# Altium schematic sheet Sheet1.SchDoc
size A4
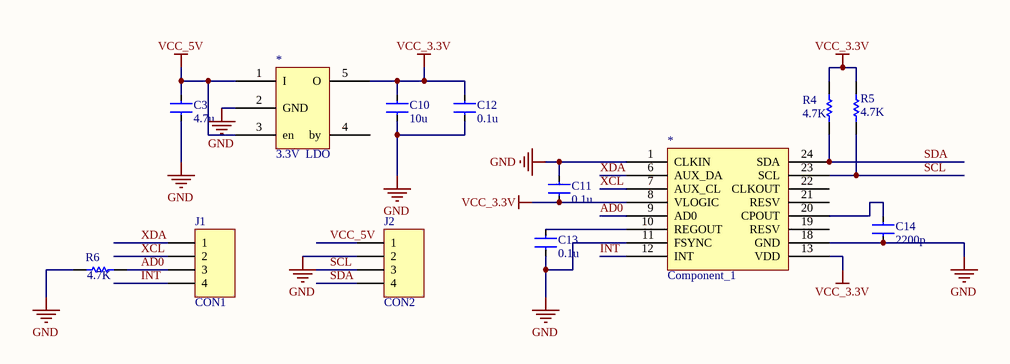
[diagram p0: Sheet1.SchDoc]

## Parts
(Parts that share a designator on the sheet are numbered #1, #2 ... from top to bottom, then left to right.)
*#1  3.3V  LDO  [SOT235]
*#2  Component_1  [MPU6050]
C3  4.7u  [1608[0603]]
C10  10u  [3.2X1.6X1.1]
C11  0.1u  [1608[0603]]
C12  0.1u  [1608[0603]]
C13  0.1u  [1608[0603]]
C14  2200p  [1608[0603]]
J1  CON1  [SH-3]
J2  CON2  [SH-3]
R4  4.7K  [1608[0603]]
R5  4.7K  [1608[0603]]
R6  4.7K  [1608[0603]]

## Nets
GND: *#1.2(GND) *#2.1(CLKIN) *#2.11(FSYNC) *#2.18(GND) C3.2 C10.2 C11.1 C12.2 C13.2 C14.2 J2.2 R6.1
VCC_3.3V: *#1.5(O) *#2.8(VLOGIC) *#2.13(VDD) C10.1 C11.2 C12.1 R4.2 R5.2
VCC_5V: *#1.1(I) *#1.3(en) C3.1 J2.1
AD0: *#2.9(AD0) J1.3 R6.2
INT: *#2.12(INT) J1.4
SCL: *#2.23(SCL) J2.3 R5.1
SDA: *#2.24(SDA) J2.4 R4.1
XCL: *#2.7(AUX_CL) J1.2
XDA: *#2.6(AUX_DA) J1.1
Net*#2_10: *#2.10(REGOUT) C13.1
Net*#2_20: *#2.20(CPOUT) C14.1

Not connected (* = marked no-connect by the designer): *#1 4(by); *#2 19(RESV) 21(RESV) 22(CLKOUT)

## Library data of the parts
C3 C10-C14 = CAP-0.1UF: SMD-CAP
J1 J2 = Header 4: Header, 4-Pin; LatestRevisionDate: 17-Jul-2002; LatestRevisionNote: Re-released for DXP Platform.; Publisher: Altium Limited
R4-R6 = Res1: Resistor; Published: 8-Jun-2000; LatestRevisionDate: 17-Jul-2002; LatestRevisionNote: Re-released for DXP Platform.; PackageReference: AXIAL-0.3; Publisher: Altium Limited; PackageDescription: Axial Device, Thru-Hole; 2 Leads; 0.3 in Pin Spacing; Value: 4.7K